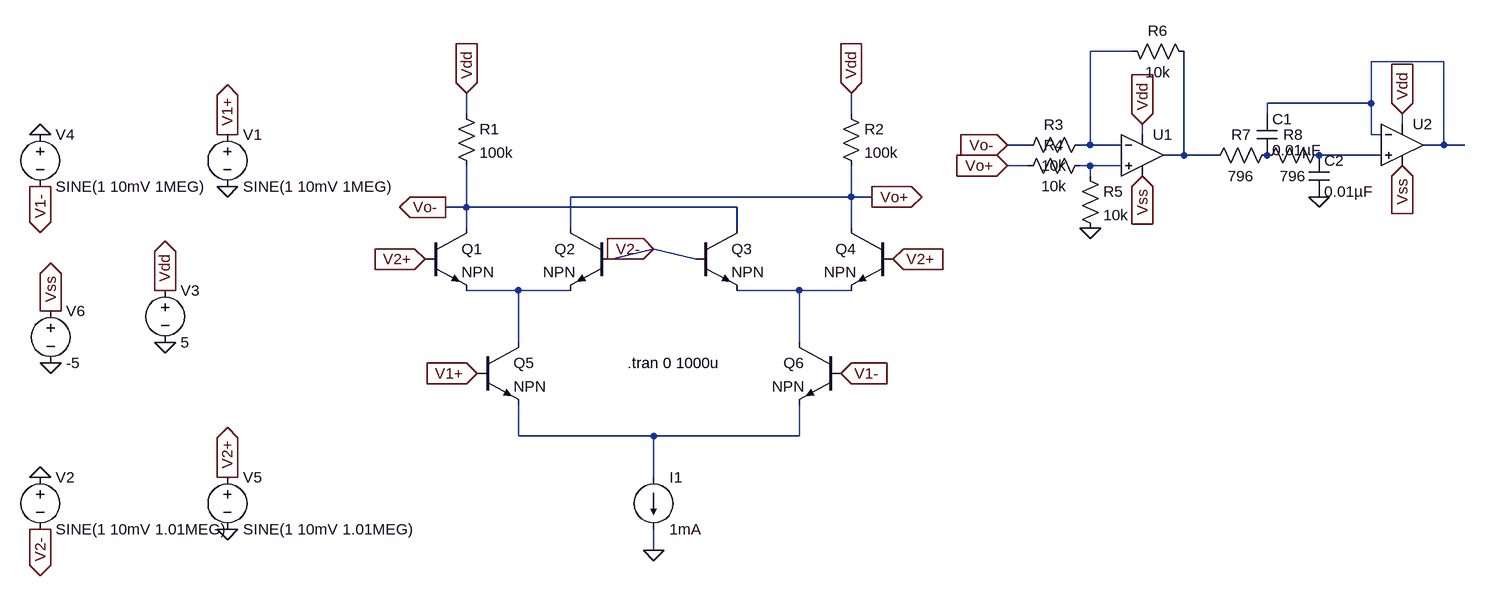
[diagram p0: schematic GilbertCell.asc]
GilbertCell.asc, the LTspice schematic file:
Version 4
SHEET 1 1700 696
WIRE 1184 -144 1120 -144
WIRE 1664 -128 1552 -128
WIRE 1552 -64 1552 -128
WIRE 1552 -64 1392 -64
WIRE 160 -48 160 -80
WIRE 752 -48 752 -80
WIRE 1392 -48 1392 -64
WIRE 1600 -32 1600 -48
WIRE 1200 -16 1200 -32
WIRE 1552 -16 1552 -64
WIRE 1568 -16 1552 -16
WIRE 1024 0 992 0
WIRE 1120 0 1120 -144
WIRE 1120 0 1104 0
WIRE 1168 0 1120 0
WIRE 1664 0 1664 -128
WIRE 1664 0 1632 0
WIRE 1696 0 1664 0
WIRE 1264 16 1264 -144
WIRE 1264 16 1232 16
WIRE 1312 16 1264 16
WIRE 1568 16 1472 16
WIRE 1024 32 992 32
WIRE 1120 32 1104 32
WIRE 1168 32 1120 32
WIRE 1120 48 1120 32
WIRE 752 80 752 32
WIRE 752 80 320 80
WIRE 784 80 752 80
WIRE 160 96 160 32
WIRE 160 96 128 96
WIRE 576 96 160 96
WIRE 160 128 160 96
WIRE 320 128 320 80
WIRE 576 128 576 96
WIRE 752 128 752 80
WIRE 384 176 448 160
WIRE 512 176 448 160
WIRE 240 224 160 224
WIRE 320 224 240 224
WIRE 672 224 576 224
WIRE 752 224 672 224
WIRE 240 304 240 224
WIRE 672 304 672 224
WIRE 240 448 240 400
WIRE 448 448 240 448
WIRE 672 448 672 400
WIRE 672 448 448 448
WIRE 448 512 448 448
WIRE 448 624 448 592
FLAG 784 80 Vo+
IOPIN 784 80 Out
FLAG 128 96 Vo-
IOPIN 128 96 Out
FLAG 176 352 V1+
IOPIN 176 352 In
FLAG 736 352 V1-
IOPIN 736 352 In
FLAG 448 624 0
FLAG 96 176 V2+
IOPIN 96 176 In
FLAG 816 176 V2+
IOPIN 816 176 In
FLAG 160 -80 Vdd
IOPIN 160 -80 In
FLAG 752 -80 Vdd
IOPIN 752 -80 In
FLAG -208 -16 V1+
IOPIN -208 -16 Out
FLAG -496 592 V2-
IOPIN -496 592 Out
FLAG -304 304 0
FLAG -304 224 Vdd
IOPIN -304 224 Out
FLAG -496 64 V1-
IOPIN -496 64 Out
FLAG -208 512 V2+
IOPIN -208 512 Out
FLAG -208 64 0
FLAG -496 -16 0
FLAG -496 512 0
FLAG -208 592 0
FLAG 448 160 V2-
IOPIN 448 160 In
FLAG 992 32 Vo+
IOPIN 992 32 In
FLAG 992 0 Vo-
IOPIN 992 0 In
FLAG 1200 -32 Vdd
IOPIN 1200 -32 In
FLAG 1200 48 Vss
IOPIN 1200 48 In
FLAG -480 336 0
FLAG -480 256 Vss
IOPIN -480 256 Out
FLAG 1120 128 0
FLAG 1472 80 0
FLAG 1600 -48 Vdd
IOPIN 1600 -48 In
FLAG 1600 32 Vss
IOPIN 1600 32 In
SYMBOL npn 96 128 R0
SYMATTR InstName Q1
SYMBOL npn 384 128 M0
SYMATTR InstName Q2
SYMBOL npn 512 128 R0
SYMATTR InstName Q3
SYMBOL npn 816 128 M0
SYMATTR InstName Q4
SYMBOL npn 176 304 R0
SYMATTR InstName Q5
SYMBOL npn 736 304 M0
SYMATTR InstName Q6
SYMBOL Voltage -208 -32 R0
SYMATTR InstName V1
SYMATTR Value SINE(1 10mV 1MEG)
SYMBOL Voltage -496 496 R0
SYMATTR InstName V2
SYMATTR Value SINE(1 10mV 1.01MEG)
SYMBOL Voltage -304 208 R0
SYMATTR InstName V3
SYMATTR Value 5
SYMBOL Voltage -496 -32 R0
SYMATTR InstName V4
SYMATTR Value SINE(1 10mV 1MEG)
SYMBOL Voltage -208 496 R0
SYMATTR InstName V5
SYMATTR Value SINE(1 10mV 1.01MEG)
SYMBOL current 448 512 R0
SYMATTR InstName I1
SYMATTR Value 1mA
SYMBOL Res 144 -64 R0
SYMATTR InstName R1
SYMATTR Value 100k
SYMBOL Res 736 -64 R0
SYMATTR InstName R2
SYMATTR Value 100k
SYMBOL UniversalOpAmp1 1200 16 R0
SYMATTR InstName U1
SYMBOL Voltage -480 240 R0
SYMATTR InstName V6
SYMATTR Value -5
SYMBOL Res 1120 -16 R90
WINDOW 0 0 56 VBottom 2
WINDOW 3 32 56 VTop 2
SYMATTR InstName R3
SYMATTR Value 10k
SYMBOL Res 1120 16 R90
WINDOW 0 0 56 VBottom 2
WINDOW 3 32 56 VTop 2
SYMATTR InstName R4
SYMATTR Value 10k
SYMBOL Res 1104 32 R0
SYMATTR InstName R5
SYMATTR Value 10k
SYMBOL Res 1280 -128 M270
WINDOW 0 32 56 VTop 2
WINDOW 3 0 56 VBottom 2
SYMATTR InstName R6
SYMATTR Value 10k
SYMBOL Res 1408 0 R90
WINDOW 0 0 56 VBottom 2
WINDOW 3 32 56 VTop 2
SYMATTR InstName R7
SYMATTR Value 796
SYMBOL Cap 1376 -48 R0
SYMATTR InstName C1
SYMATTR Value 0.01µF
SYMBOL Cap 1456 16 R0
SYMATTR InstName C2
SYMATTR Value 0.01µF
SYMBOL Res 1488 0 R90
WINDOW 0 0 56 VBottom 2
WINDOW 3 32 56 VTop 2
SYMATTR InstName R8
SYMATTR Value 796
SYMBOL UniversalOpAmp1 1600 0 R0
SYMATTR InstName U2
TEXT 408 336 Left 2 !.tran 0 1000u

The netlist it stands for:
* GilbertCell.asc
Q1 Vo- V2+ N006 0 NPN
Q2 Vo+ V2- N006 0 NPN
Q3 Vo- V2- N007 0 NPN
Q4 Vo+ V2+ N007 0 NPN
Q5 N006 V1+ N008 0 NPN
Q6 N007 V1- N008 0 NPN
V1 V1+ 0 SINE(1 10mV 1MEG)
V2 0 V2- SINE(1 10mV 1.01MEG)
V3 Vdd 0 5
V4 0 V1- SINE(1 10mV 1MEG)
V5 V2+ 0 SINE(1 10mV 1.01MEG)
I1 N008 0 1mA
R1 Vdd Vo- 100k
R2 Vdd Vo+ 100k
XU1 N005 N001 Vdd Vss N003 level1 Avol=1Meg GBW=10Meg Vos=0 En=0 Enk=0 In=0 Ink=0 Rin=500Meg  ; pins In+ In- V+ V- OUT
V6 Vss 0 -5
R3 N001 Vo- 10k
R4 N005 Vo+ 10k
R5 N005 0 10k
R6 N003 N001 10k
R7 P001 N003 796
C1 N002 P001 0.01µF
C2 N004 0 0.01µF
R8 N004 P001 796
XU2 N004 N002 Vdd Vss N002 level1 Avol=1Meg GBW=10Meg Vos=0 En=0 Enk=0 In=0 Ink=0 Rin=500Meg  ; pins In+ In- V+ V- OUT
.model NPN NPN
.model PNP PNP
.lib standard.bjt
.tran 0 1000u
.lib UniversalOpAmp1.lib
.backanno
.end